# Altium schematic sheet SNES SuperCIC v1.0.SchDoc
size A4; SheetNumber: 1; SheetTotal: 1
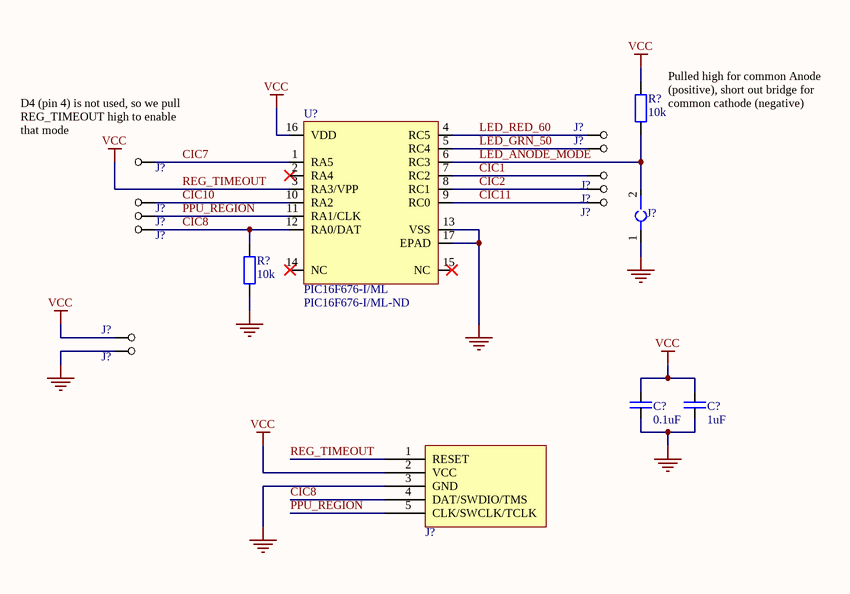
[diagram p0: SNES SuperCIC v1.0.SchDoc]

## Parts
(Parts that share a designator on the sheet are numbered #1, #2 ... from top to bottom, then left to right.)
C?#1  0.1uF  [C0402]
C?#2  1uF  [C0402]
J?#1  SP  [SP2]  (value not drawn)  (no BOM)
J?#2  SP  [SP2]  (value not drawn)  (no BOM)
J?#3  SP  [SP2]  (value not drawn)  (no BOM)
J?#4  SP  [SP2]  (value not drawn)  (no BOM)
J?#5  SP  [SP2]  (value not drawn)  (no BOM)
J?#6  SP  [SP2]  (value not drawn)  (no BOM)
J?#7  SP  [SP2]  (value not drawn)  (no BOM)
J?#8  SP  [SP2]  (value not drawn)  (no BOM)
J?#9  SP  [SP2]  (value not drawn)  (no BOM)
J?#10  SOLDER_BRIDGE  [SOLDER_BRIDGE]  (value not drawn)
J?#11  SP  [SP2]  (value not drawn)  (no BOM)
J?#12  SP  [SP2]  (value not drawn)  (no BOM)
J?#13  JTAG-SWD2  [SP2-5]  (value not drawn)
R?#1  10k  [R0402]
R?#2  10k  [R0402]
U?  PIC16F676-I/ML  Supplier Part Number 1: PIC16F676-I/ML-ND  [QFN-16]

## Nets
GND: C?#1.1 C?#2.1 J?#10.1 J?#12.1 J?#13.3(GND) R?#2.1 U?.13(VSS) U?.17(EPAD)
REG_TIMEOUT: C?#1.2 C?#2.2 J?#11.1 J?#13.1(RESET) J?#13.2(VCC) R?#1.2 U?.3(RA3/VPP) U?.16(VDD)  [also labelled VCC]
CIC1: J?#4.1 U?.7(RC2)
CIC2: J?#5.1 U?.8(RC1)
CIC7: J?#3.1 U?.1(RA5)
CIC8: J?#9.1 J?#13.4(DAT/SWDIO/TMS) R?#2.2 U?.12(RA0/DAT)
CIC10: J?#6.1 U?.10(RA2)
CIC11: J?#7.1 U?.9(RC0)
LED_ANODE_MODE: J?#10.2 R?#1.1 U?.6(RC3)
LED_GRN_50: J?#2.1 U?.5(RC4)
LED_RED_60: J?#1.1 U?.4(RC5)
PPU_REGION: J?#8.1 J?#13.5(CLK/SWCLK/TCLK) U?.11(RA1/CLK)

Not connected (* = marked no-connect by the designer): U? 2(RA4)* 14(NC)* 15(NC)*

## Notes on the sheet
- (near J?#3) D4 (pin 4) is not used, so we pull REG_TIMEOUT high to enable that mode
- (near R?#1) Pulled high for common Anode (positive), short out bridge for common cathode (negative)

## Library data of the parts
C?#1 = CAP_0UF1_0402: Capacitor Ceramic 0.1uF 16V X5R 0402; Manufacturer: Yageo; Manufacturer Part Number: CC0402KRX7R7BB104; Capacitance: 0.10µF; Tolerance: ±10%; Temperature Coefficient: X7R; Supplier 1: Digi-Key; RoHS: RoHS Compliant; Category: Capacitors; Stock 1: 190000; Pricing 1: 10000=0.00149, 20000=0.00142, 30000=0.00135, 50000=0.0012, 100000=0.00097 (GBP); Packaging: Tape & Reel (TR); Voltage - Rated: 16V; Mounting Type: Surface Mount, MLCC; Operating Temperature: -55°C ~ 125°C; Applications: General Purpose; Ratings: -; Package / Case: 0402 (1005 Metric); Size / Dimension: 0.039" L x 0.020" W (1.00mm x 0.50mm); Height - Seated (Max): -; Thickness (Max): 0.022" (0.55mm); Lead Spacing: -; Features: -; Lead Style: -; ComponentLink1URL: http://www.yageo.com/documents/recent/UPY-GPHC_X7R_6.3V-to-50V_13.pdf; ComponentLink1Description: http://www.yageo.com/documents/recent/UPY-GPHC_X7R_6.3V-to-50V_13.pdf; Supplier Part Number 1: 311-1338-2-ND
C?#2 = CAP_1UF_0402: Capacitor Ceramic 1uF 10V X5R 0402; Manufacturer: Murata Electronics North America; Manufacturer Part Number: GRM155R61A105KE15D; Capacitance: 1µF; Tolerance: ±10%; Supplier 1: Digi-Key; RoHS: RoHS Compliant; Category: Capacitors; Stock 1: 2580000; Pricing 1: 10000=0.0051, 20000=0.00485, 30000=0.00461, 50000=0.00412, 100000=0.00334 (GBP); Packaging: Tape & Reel (TR); Voltage - Rated: 10V; Temperature Coefficient: X5R; Mounting Type: Surface Mount, MLCC; Operating Temperature: -55°C ~ 85°C; Applications: General Purpose; Ratings: -; Package / Case: 0402 (1005 Metric); Size / Dimension: 0.039" L x 0.020" W (1.00mm x 0.50mm); Height - Seated (Max): -; Thickness (Max): 0.022" (0.55mm); Lead Spacing: -; Features: -; Lead Style: -; ComponentLink1URL: http://www.murata.com/~/media/webrenewal/support/library/catalog/products/capacitor/mlcc/c02e.pdf; ComponentLink1Description: http://www.murata.com/~/media/webrenewal/support/library/catalog/products/capacitor/mlcc/c02e.pdf; Supplier Part Number 1: 490-3890-2-ND
J?#1-J?#9 J?#11 J?#12 = SP: Solder pad
J?#10 = SOLDER_BRIDGE: Solder bridge
J?#13 = JTAG-SWD2: JTAG-SWD Connector
R?#1 R?#2 = RES_10K_0402: Resistor 10k 0.063W 0402; Manufacturer: Yageo; Manufacturer Part Number: RC0402FR-0710KL; Tolerance: ±1%; Power (Watts): 0.063W, 1/16W; Temperature Coefficient: ±100ppm/°C; Supplier 1: Digi-Key; RoHS: RoHS Compliant; Category: Resistors; Stock 1: 14210000; Pricing 1: 10000=0.00094, 30000=0.00083, 50000=0.00076, 100000=0.00074 (GBP); Packaging: Tape & Reel (TR); Resistance (Ohms): 10k; Composition: Thick Film; Features: Moisture Resistant; Operating Temperature: -55°C ~ 155°C; Package / Case: 0402 (1005 Metric); Supplier Device Package: 0402; Size / Dimension: 0.039" L x 0.020" W (1.00mm x 0.50mm); Height: 0.016" (0.40mm); Number of Terminations: 2; ComponentLink1URL: http://www.yageo.com/documents/recent/PYu-RC_Group_51_RoHS_L_04.pdf; ComponentLink1Description: http://www.yageo.com/documents/recent/PYu-RC_Group_51_RoHS_L_04.pdf; Supplier Part Number 1: 311-10.0KLRTR-ND
U? = PIC16F676-I/ML: MCU 8-bit PIC RISC 1.75KB Flash 2.5V/3.3V/5V Automotive 16-Pin QFN EP Tube; Manufacturer: Microchip; Supplier 1: Digi-Key; Manufacturer Part Number: PIC16F676-I/ML; RoHS: Yes; Category: Microcontrollers; Stock 1: 513; Pricing 1: 1=1.69000, 25=1.66480 (USD); ComponentLink1URL: https://datasheet.ciiva.com/17387/40039f-17387672.pdf?src-supplier=Avnet+Europe; ComponentLink1Description: https://datasheet.ciiva.com/17387/40039f-17387672.pdf?src-supplier=Avnet+Europe; ComponentLink2URL: https://datasheet.ciiva.com/1560/40039f-1560604.pdf?src-supplier=Digi-Key; ComponentLink2Description: https://datasheet.ciiva.com/1560/40039f-1560604.pdf?src-supplier=Digi-Key; ComponentLink3URL: https://datasheet.ciiva.com/9241/40039f-9241964.pdf?src-supplier=Avnet; ComponentLink3Description: https://datasheet.ciiva.com/9241/40039f-9241964.pdf?src-supplier=Avnet